# EAGLE schematic battery_managmement (EAGLE 7.2.0)
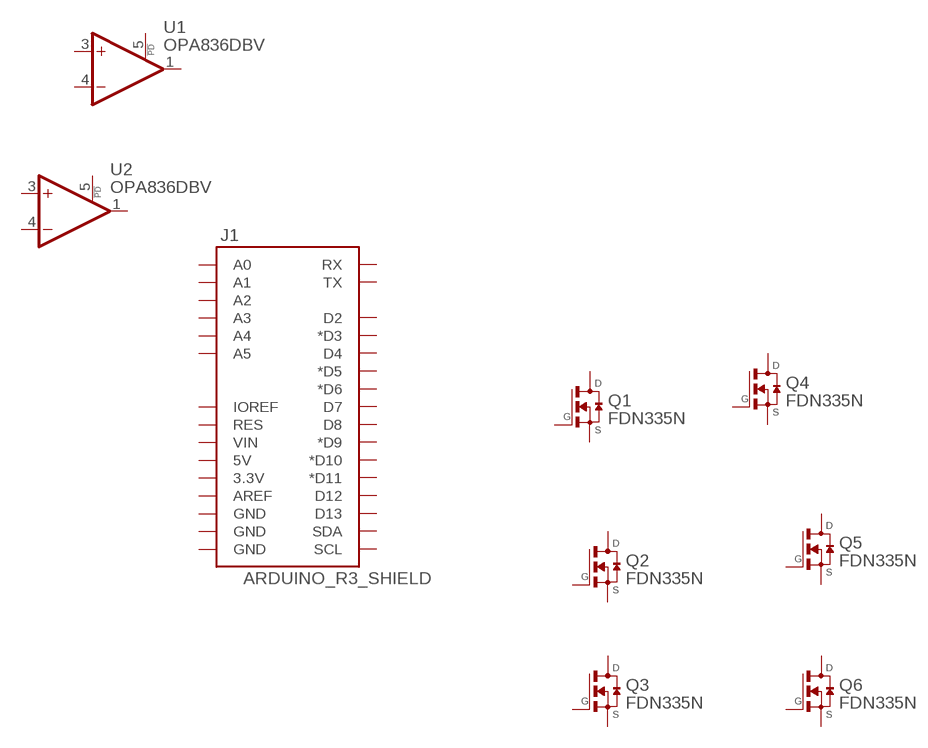
[diagram p0: schematic, sheet 1]

## Parts
J1  ARDUINO_R3_SHIELD  [UNO_R3_SHIELD]
Q1  FDN335N  [SSOT-3]
Q2  FDN335N  [SSOT-3]
Q3  FDN335N  [SSOT-3]
Q4  FDN335N  [SSOT-3]
Q5  FDN335N  [SSOT-3]
Q6  FDN335N  [SSOT-3]
U1  OPA836DBV  [SOT23-6]
U2  OPA836DBV  [SOT23-6]
Unconnected: J1.3.3V J1.5V J1.A0 J1.A1 J1.A2 J1.A3 J1.A4 J1.A5 J1.AREF J1.D2 J1.D3(*D3) J1.D4 J1.D5(*D5) J1.D6(*D6) J1.D7 J1.D8 J1.D9(*D9) J1.D10(*D10) J1.D11(*D11) J1.D12 J1.D13 J1.GND@0(GND) J1.GND@1(GND) J1.GND@2(GND) J1.IOREF J1.RES J1.RX J1.SCL J1.SDA J1.TX J1.VIN Q1.1(G) Q1.2(S) Q1.3(D) Q2.1(G) Q2.2(S) Q2.3(D) Q3.1(G) Q3.2(S) Q3.3(D) Q4.1(G) Q4.2(S) Q4.3(D) Q5.1(G) Q5.2(S) Q5.3(D) Q6.1(G) Q6.2(S) Q6.3(D) U1.1(OUT) U1.3(+IN) U1.4(-IN) U1.5(PD) U2.1(OUT) U2.3(+IN) U2.4(-IN) U2.5(PD)

## Power pins joined to a net without a drawn wire
V+: U1.6(V+) U2.6(V+)
V-: U1.2(V-) U2.2(V-)

## Library data of the parts
J1 = SparkFun-Boards:ARDUINO_R3_SHIELD: Shield form compatible with the Arduino Uno R3.
Q1-Q6 = transistor-fet:FDN335N: N-Channel MOSFET 2.5V Specified PowerTrench
U1 U2 = op-amp:OPA836DBV: OP-AMP Very Low-Power, Rail-to-Rail Out, Negative Rail In, VFB Op Amp